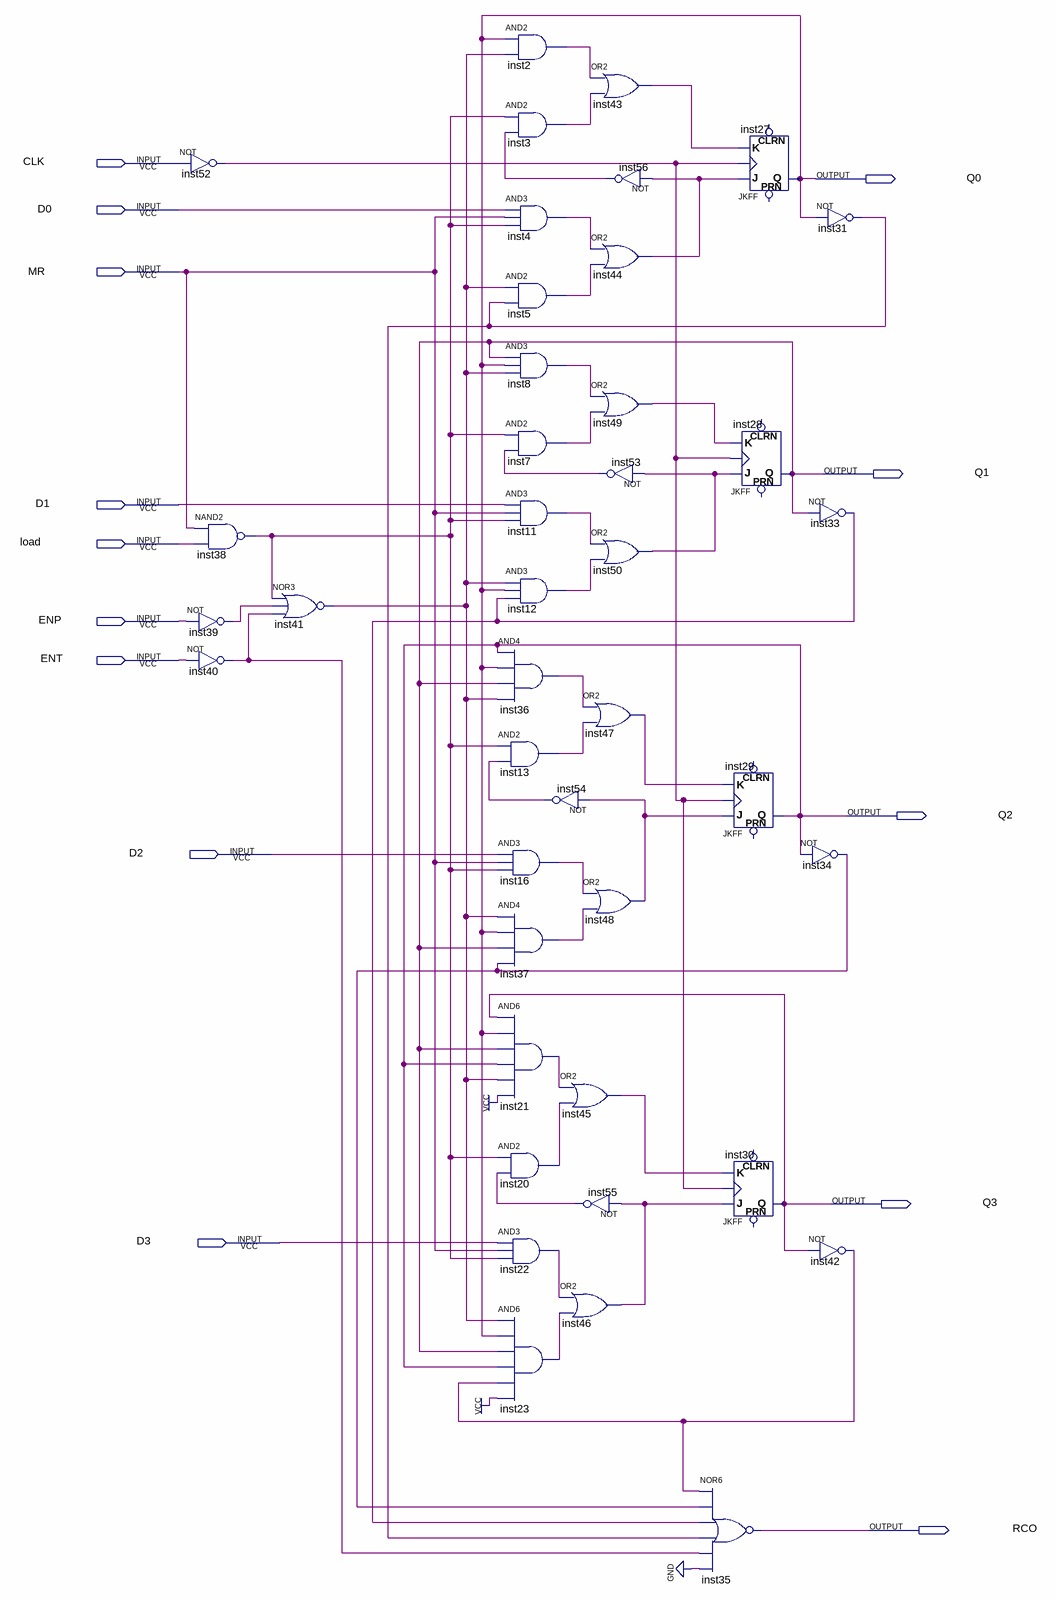
[diagram p0: schematic sheet]
// Quartus schematic ci_74LS161.bdf as structural Verilog: 42 symbols, 14 pins
module ci_74LS161 (
  input  CLK,
  input  D0,
  input  MR,
  input  D1,
  input  load,
  input  ENP,
  input  ENT,
  input  D2,
  input  D3,
  output Q0,
  output Q1,
  output Q2,
  output Q3,
  output RCO
);

  wire inst2_out, inst3_out, inst4_out, inst5_out, inst7_out, inst8_out, inst11_out, inst12_out, inst13_out,
       inst16_out, inst20_out, inst21_out, inst22_out, inst23_out, inst31_out, inst33_out, inst34_out,
       inst36_out, inst37_out, inst38_out, inst39_out, inst40_out, inst41_out, inst42_out, inst43_out,
       inst44_out, inst45_out, inst46_out, inst47_out, inst48_out, inst49_out, inst50_out, inst52_out,
       inst53_out, inst54_out, inst55_out, inst56_out;

  not inst52 (inst52_out, CLK);
  nand inst38 (inst38_out, MR, load);
  not inst39 (inst39_out, ENP);
  not inst40 (inst40_out, ENT);
  nor inst41 (inst41_out, inst38_out, inst39_out, inst40_out);
  and inst2 (inst2_out, Q0, inst41_out);
  and inst3 (inst3_out, inst38_out, inst56_out);
  and inst4 (inst4_out, D0, MR, inst38_out);
  and inst5 (inst5_out, inst41_out, inst31_out);
  and inst8 (inst8_out, Q1, Q0, inst41_out);
  and inst7 (inst7_out, inst38_out, inst53_out);
  and inst11 (inst11_out, D1, MR, inst38_out);
  and inst12 (inst12_out, inst41_out, Q0, inst33_out);
  and inst36 (inst36_out, Q2, Q0, Q1, inst41_out);
  and inst13 (inst13_out, inst38_out, inst54_out);
  and inst16 (inst16_out, D2, MR, inst38_out);
  and inst37 (inst37_out, inst41_out, Q0, Q1, inst34_out);
  and inst21 (inst21_out, Q3, Q0, Q1, Q2, inst41_out, 1'b1);
  and inst20 (inst20_out, inst38_out, inst55_out);
  and inst22 (inst22_out, D3, MR, inst38_out);
  and inst23 (inst23_out, inst41_out, Q0, Q1, Q2, inst42_out, 1'b1);
  or inst47 (inst47_out, inst36_out, inst13_out);
  not inst54 (inst54_out, inst48_out);
  or inst48 (inst48_out, inst16_out, inst37_out);
  or inst45 (inst45_out, inst21_out, inst20_out);
  not inst55 (inst55_out, inst46_out);
  or inst46 (inst46_out, inst22_out, inst23_out);
  or inst43 (inst43_out, inst2_out, inst3_out);
  not inst56 (inst56_out, inst44_out);
  or inst44 (inst44_out, inst4_out, inst5_out);
  or inst49 (inst49_out, inst8_out, inst7_out);
  not inst53 (inst53_out, inst50_out);
  or inst50 (inst50_out, inst11_out, inst12_out);
  nor inst35 (RCO, inst42_out, inst34_out, inst33_out, inst31_out, inst40_out, 1'b0);
  JKFF inst27 (.K(inst43_out), .J(inst44_out), .CLK(inst52_out), .Q(Q0));  // open: PRN, CLRN
  JKFF inst28 (.K(inst49_out), .J(inst50_out), .CLK(inst52_out), .Q(Q1));  // open: PRN, CLRN
  JKFF inst29 (.K(inst47_out), .J(inst48_out), .CLK(inst52_out), .Q(Q2));  // open: PRN, CLRN
  JKFF inst30 (.K(inst45_out), .J(inst46_out), .CLK(inst52_out), .Q(Q3));  // open: PRN, CLRN
  not inst31 (inst31_out, Q0);
  not inst33 (inst33_out, Q1);
  not inst34 (inst34_out, Q2);
  not inst42 (inst42_out, Q3);
endmodule
